# Altium schematic sheet USB_keyholder.SchDoc: Наименование
size 420 x 297 mm; ApprovedBy: Утвердил; CheckedBy: Проверил; Author: Разработал; CompanyName: Организация; DrawnBy: Н.Контр; Engineer: Т.Контр; SheetNumber: 1; SheetTotal: 1; PageSetup: Record=PageOptions|CenterHorizontal=True|CenterVertical=True|PrintScale=0.94|XCorrection=1.00|YCorrection=1.00|PrintKind=1|BorderSize=5000000|LeftOffset=0|BottomOffset=0|Orientation=1|PaperLength=1000|PaperWidth=1000|Scale=100|PaperSource=7|PrintQuality=-4|MediaType=1|DitherType=10|PaperKind=A4|PrintScaleMode=1; DecimalNumber: Децимальный номер; HeadOfSector: Нач. сектора; MainDevice: Перв.примен.; Name: Наименование; DocumentName: Sheet1.SCHDOC
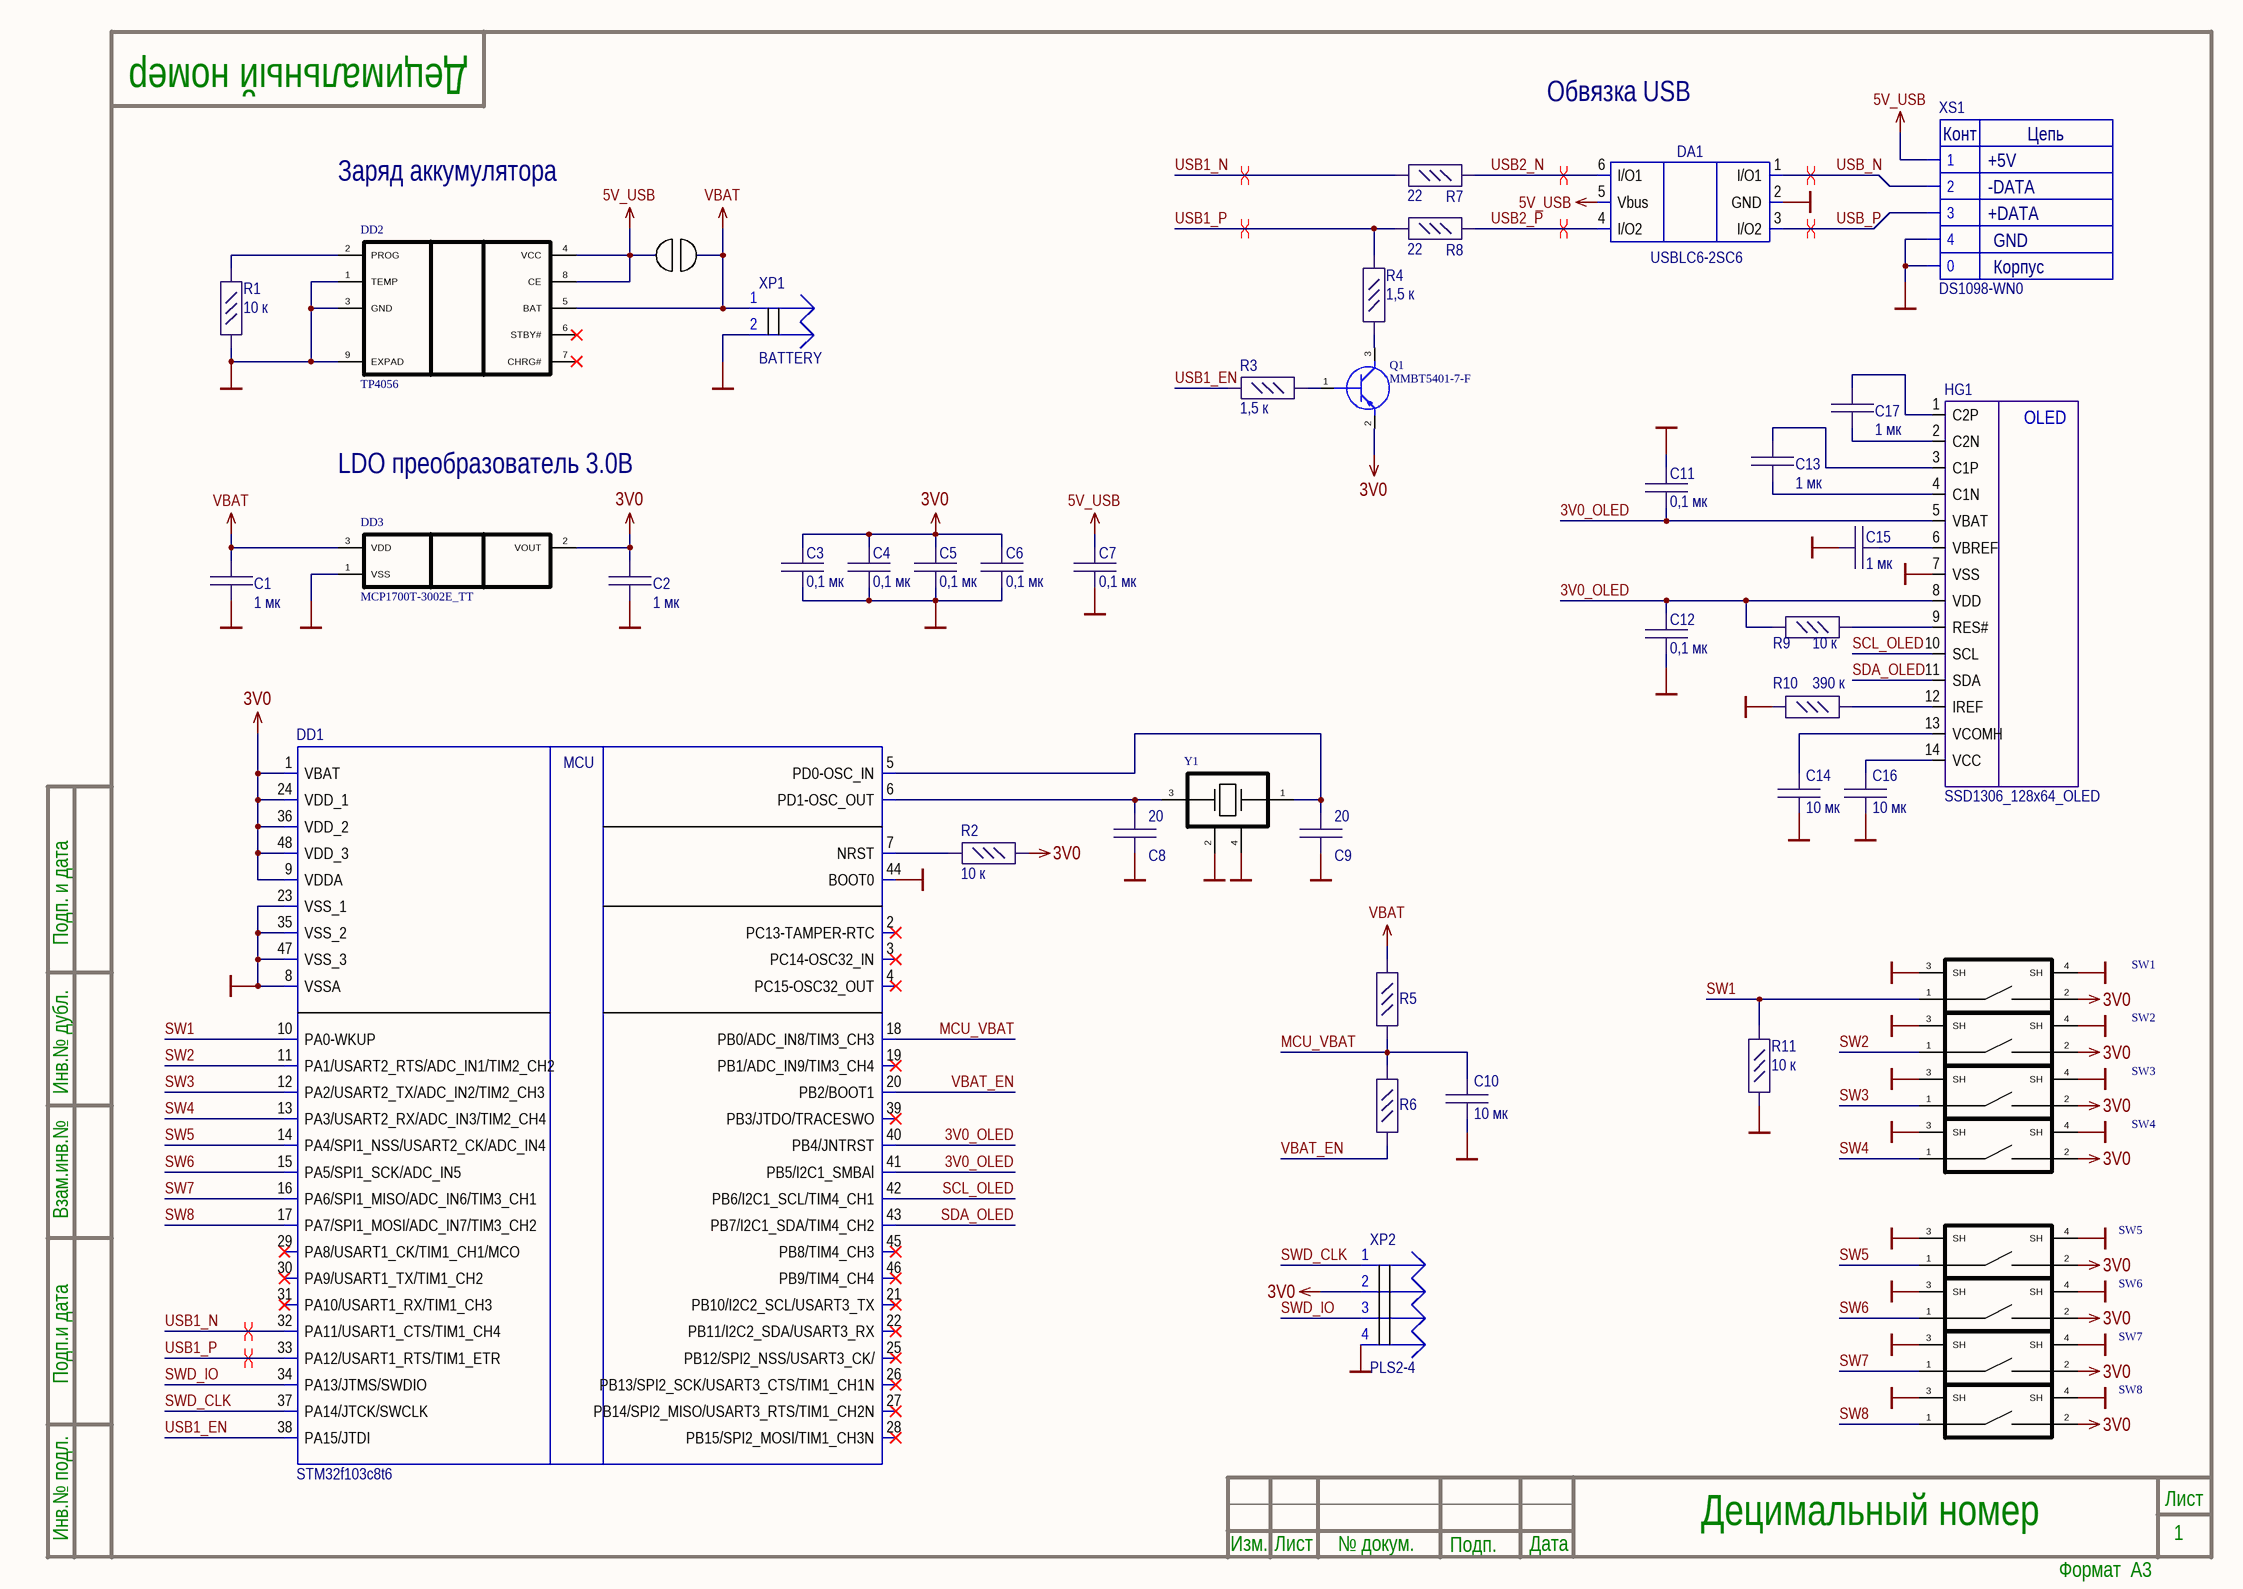
[diagram p0: USB_keyholder.SchDoc]

## Parts
C1  1 мк  [C_0603]
C2  1 мк  [C_0603]
C3  0,1 мк  [C_0603]
C4  0,1 мк  [C_0603]
C5  0,1 мк  [C_0603]
C6  0,1 мк  [C_0603]
C7  0,1 мк  [C_0603]
C8  20  [C_0603]
C9  20  [C_0603]
C10  10 мк  [C_0603]
C11  0,1 мк  [C_0603]
C12  0,1 мк  [C_0603]
C13  1 мк  [C_0603]
C14  10 мк  [C_0603]
C15  1 мк  [C_0603]
C16  10 мк  [C_0603]
C17  1 мк  [C_0603]
DA1  USBLC6-2SC6  [SOT-23-6]
DD1  STM32f103c8t6  [LQFP48]
DD2  TP4056  [SOIC127P600X175-9N]
DD3  MCP1700T-3002E_TT  [SOT95P237X112-3N]
HG1  SSD1306_128х64_OLED  [14_pin_OLED]
Q1  MMBT5401-7-F  [SOT95P240X120-3N]
R1  10 к  [R_0603]
R2  10 к  [R_0603]
R3  1,5 к  [R_0603]
R4  1,5 к  [R_0603]
R5  1 M  [R_0603]  (value not drawn)
R6  1 M  [R_0603]  (value not drawn)
R7  22  [R_0603]
R8  22  [R_0603]
R9  10 к  [R_0603]
R10  390 к  [R_0603]
R11  10 к  [R_0603]
SW1  TSA365G00D  [1TS002G26003500CT]  (value not drawn)
SW2  TSA365G00D  [1TS002G26003500CT]  (value not drawn)
SW3  TSA365G00D  [1TS002G26003500CT]  (value not drawn)
SW4  TSA365G00D  [1TS002G26003500CT]  (value not drawn)
SW5  TSA365G00D  [1TS002G26003500CT]  (value not drawn)
SW6  TSA365G00D  [1TS002G26003500CT]  (value not drawn)
SW7  TSA365G00D  [1TS002G26003500CT]  (value not drawn)
SW8  TSA365G00D  [1TS002G26003500CT]  (value not drawn)
X1  Solder_jumper  [Solder_jumper]  (value not drawn)
XP1  BATTERY  [PLS-2]
XP2  PLS2-4  [4 pin debug]
XS1  DS1098-WN0  [DS1098-WN0]
Y1  X322512MSB4SI  [X322512MSB4SI]  (value not drawn)

## Nets
3V0: C2.2 C3.2 C4.2 C5.2 C6.2 DD1.1(VBAT) DD1.9(VDDA) DD1.24(VDD_1) DD1.36(VDD_2) DD1.48(VDD_3) DD3.2(VOUT) Q1.2(E) R2.1 SW1.2(VOUT) SW2.2(VOUT) SW3.2(VOUT) SW4.2(VOUT) SW5.2(VOUT) SW6.2(VOUT) SW7.2(VOUT) SW8.2(VOUT) XP2.2
5V_USB: C7.2 DA1.5(Vbus) DD2.4(VCC) DD2.8(CE) X1.1 XS1.1
GND: C1.1 C2.1 C3.1 C4.1 C5.1 C6.1 C7.1 C8.1 C9.1 C10.1 C11.2 C12.1 C14.1 C15.2 C16.1 DA1.2(GND) DD1.8(VSSA) DD1.23(VSS_1) DD1.35(VSS_2) DD1.44(BOOT0) DD1.47(VSS_3) DD2.1(TEMP) DD2.3(GND) DD2.9(EXPAD) DD3.1(VSS) HG1.7(VSS) R1.1 R10.1 R11.1 SW1.3(SH) SW1.4(SH) SW2.3(SH) SW2.4(SH) SW3.3(SH) SW3.4(SH) SW4.3(SH) SW4.4(SH) SW5.3(SH) SW5.4(SH) SW6.3(SH) SW6.4(SH) SW7.3(SH) SW7.4(SH) SW8.3(SH) SW8.4(SH) XP1.2 XP2.4 XS1.0 XS1.4 Y1.2 Y1.4
VBAT: C1.2 DD2.5(BAT) DD3.3(VDD) R5.2 X1.2 XP1.1
3V0_OLED: C11.1 C12.2 DD1.40(PB4/JNTRST) DD1.41(PB5/I2C1_SMBAl) HG1.5(VBAT) HG1.8(VDD) R9.2
MCU_VBAT: C10.2 DD1.18(PB0/ADC_IN8/TIM3_CH3) R5.1 R6.2
SCL_OLED: DD1.42(PB6/I2C1_SCL/TIM4_CH1) HG1.10(SCL)
SDA_OLED: DD1.43(PB7/I2C1_SDA/TIM4_CH2) HG1.11(SDA)
SW1: DD1.10(PA0-WKUP) R11.2 SW1.1(VSS)
SW2: DD1.11(PA1/USART2_RTS/ADC_IN1/TIM2_CH2) SW2.1(VSS)
SW3: DD1.12(PA2/USART2_TX/ADC_IN2/TIM2_CH3) SW3.1(VSS)
SW4: DD1.13(PA3/USART2_RX/ADC_IN3/TIM2_CH4) SW4.1(VSS)
SW5: DD1.14(PA4/SPI1_NSS/USART2_CK/ADC_IN4) SW5.1(VSS)
SW6: DD1.15(PA5/SPI1_SCK/ADC_IN5) SW6.1(VSS)
SW7: DD1.16(PA6/SPI1_MISO/ADC_IN6/TIM3_CH1) SW7.1(VSS)
SW8: DD1.17(PA7/SPI1_MOSI/ADC_IN7/TIM3_CH2) SW8.1(VSS)
SWD_CLK: DD1.37(PA14/JTCK/SWCLK) XP2.1
SWD_IO: DD1.34(PA13/JTMS/SWDIO) XP2.3
USB1_EN: DD1.38(PA15/JTDI) R3.2
USB1_N: DD1.32(PA11/USART1_CTS/TIM1_CH4) R7.1
USB1_P: DD1.33(PA12/USART1_RTS/TIM1_ETR) R4.2 R8.1
USB2_N: DA1.6(I/O1) R7.2
USB2_P: DA1.4(I/O2) R8.2
USB_N: DA1.1(I/O1) XS1.2
USB_P: DA1.3(I/O2) XS1.3
VBAT_EN: DD1.20(PB2/BOOT1) R6.1
NetC8_2: C8.2 DD1.6(PD1-OSC_OUT) Y1.3
NetC9_2: C9.2 DD1.5(PD0-OSC_IN) Y1.1
NetC13_1: C13.1 HG1.4(C1N)
NetC13_2: C13.2 HG1.3(C1P)
NetC14_2: C14.2 HG1.13(VCOMH)
NetC15_1: C15.1 HG1.6(VBREF)
NetC16_2: C16.2 HG1.14(VCC)
NetC17_1: C17.1 HG1.2(C2N)
NetC17_2: C17.2 HG1.1(C2P)
NetDD1_7: DD1.7(NRST) R2.2
NetDD2_2: DD2.2(PROG) R1.2
NetHG1_9: HG1.9(RES#) R9.1
NetHG1_12: HG1.12(IREF) R10.2
NetQ1_1: Q1.1(B) R3.1
NetQ1_3: Q1.3(C) R4.1

Not connected (* = marked no-connect by the designer): DD1 2(PC13-TAMPER-RTC)* 3(PC14-OSC32_IN)* 4(PC15-OSC32_OUT)* 19(PB1/ADC_IN9/TIM3_CH4)* 21(PB10/I2C2_SCL/USART3_TX)* 22(PB11/I2C2_SDA/USART3_RX)* 25(PB12/SPI2_NSS/USART3_CK/)* 26(PB13/SPI2_SCK/USART3_CTS/TIM1_CH1N)* 27(PB14/SPI2_MISO/USART3_RTS/TIM1_CH2N)* 28(PB15/SPI2_MOSI/TIM1_CH3N)* 29(PA8/USART1_CK/TIM1_CH1/MCO)* 30(PA9/USART1_TX/TIM1_CH2)* 31(PA10/USART1_RX/TIM1_CH3)* 39(PB3/JTDO/TRACESWO)* 45(PB8/TIM4_CH3)* 46(PB9/TIM4_CH4)*; DD2 6(STBY#)* 7(CHRG#)*

## Layout directives
differential pair: USB1_N, USB1_P, USB2_N, USB2_P, USB_N, USB_P

## Notes on the sheet
- Обвязка USB
- Заряд аккумулятора
- LDO преобразователь 3.0В
- Подп. и дата
- Инв.№ дубл.
- Взам.инв.№
- Подп.и дата
- Инв.№ подл.
- Изм.
- Лист
- № докум.
- Подп.
- Дата
- Формат  A3
- (in symbol DS1098-WN0) Конт; Цепь; +5V; -DATA; +DATA; GND; Корпус
- (in symbol SSD1306_128х64_OLED) OLED
- (in symbol STM32f103c8t6) MCU

## Library data of the parts
C1 C2 C13 C15 C17 = GRM188R61E225MA12D: CAP CER 2.2UF 25V X5R 0603; Manufacturer: Murata Electronics; Value: 1µF; Part Number: GRM188R61E225MA12D; ComponentLink1URL: https://search.murata.co.jp/Ceramy/image/img/A01X/G101/ENG/GRM188R61E225MA12-01.pdf; ComponentLink1Description: Datasheet; Component Type: Capasitor; LCSC Part #: C15849
C3-C7 C11 C12 = GRM188R72A104MA35D: CAP CER 0.1UF 100V X7R 0603; Manufacturer: Murata Electronics; Value: 0.1µF; Part Number: GRM188R72A104MA35D; ComponentLink1URL: https://search.murata.co.jp/Ceramy/image/img/A01X/G101/ENG/GRM188R72A104MA35-01.pdf; ComponentLink1Description: Datasheet; Component Type: Capasitor; LCSC Part #: C14663
C8 C9 = GRM1885C1H100FA01D: CAP CER 20PF 50V C0G/NP0 0603; Manufacturer: Murata Electronics; Part Number: GRM1885C1H100FA01D; Value: 20pF; ComponentLink1URL: https://www.murata.com/~/media/webrenewal/support/library/catalog/products/capacitor/mlcc/c02e.ashx?la=en-us; ComponentLink1Description: Datasheet; Component Type: Capasitor; LCSC Part #: C1648
C10 C14 C16 = GRM188R61A106KE69J: CAP CER 10UF 10V X5R 0603; Manufacturer: Murata Electronics; Value: 10µF; Part Number: GRM188R61A106KE69J; ComponentLink1URL: https://search.murata.co.jp/Ceramy/image/img/A01X/G101/ENG/GRM188R61A106KE69-01.pdf; ComponentLink1Description: Datasheet; Component Type: Capasitor; LCSC Part #: C19702
DD2 = TP4056: Li Ion charger; LCSC Part #: C16581
Q1 = MMBT5401-7-F: Transistor BJT PNP; Manufacturer_Name: Diodes Inc.; Datasheet Link: https://www.diodes.com/assets/Datasheets/ds30057.pdf; Height: 1.2mm; Manufacturer_Part_Number: MMBT5401-7-F; Mouser Part Number: 621-MMBT5401-F; Mouser Price/Stock: https://www.mouser.co.uk/ProductDetail/Diodes-Incorporated/MMBT5401-7-F?qs=i73nB8jq7%2FziVmdJmjed1Q%3D%3D; Arrow Part Number: MMBT5401-7-F; Arrow Price/Stock: https://www.arrow.com/en/products/mmbt5401-7-f/diodes-incorporated?region=nac; LCSC Part #: C8326
R1 R2 R9 R11 = CR0603-FX-1002ELF: RES SMD 10K OHM 1% 1/10W 0603; Manufacturer: Bourns Inc.; Part Number: CR0603-FX-1002ELF; Value: 10 к; ComponentLink1URL: https://www.bourns.com/pdfs/chpreztr.pdf; ComponentLink1Description: Datasheet; Component Type: Resistor; LCSC Part #: C25804
R3 R4 = CR0603-FX-1501ELF: RES SMD 1.5K OHM 1% 1/10W 0603; Manufacturer: Bourns Inc.; Part Number: CR0603-FX-1501ELF; Value: 1,5 к; ComponentLink1URL: https://www.bourns.com/pdfs/chpreztr.pdf; ComponentLink1Description: Datasheet; Component Type: Resistor; LCSC Part #: C22843
R5 R6 = CR0603-FX-1004ELF: RES SMD 1M OHM 1% 1/10W 0603; Manufacturer: Bourns Inc.; Part Number: CR0603-FX-1004ELF; Value: 1 M; ComponentLink1URL: https://www.bourns.com/pdfs/chpreztr.pdf; ComponentLink1Description: Datasheet; Component Type: Resistor; LCSC Part #: C22935
R7 R8 = CR0603-FX-22R0ELF: RES SMD 22 OHM 1% 1/10W 0603; Manufacturer: Bourns Inc.; Part Number: CR0603-FX-22R0ELF; Value: 22; ComponentLink1URL: https://www.bourns.com/pdfs/chpreztr.pdf; ComponentLink1Description: Datasheet; Component Type: Resistor; LCSC Part #: C23345
R10 = CR0603-FX-3903ELF: RES SMD 390K OHM 1% 1/10W 0603; Manufacturer: Bourns Inc.; Part Number: CR0603-FX-3903ELF; Value: 390 к; ComponentLink1URL: https://www.bourns.com/pdfs/chpreztr.pdf; ComponentLink1Description: Datasheet; Component Type: Resistor; LCSC Part #: C23150
XP1 = PLS-2
Y1 = X322512MSB4SI: 12MHz Crystal resonator; LCSC Part #: C9002
DA1 = USBLC6-2SC6: HelpURL: https://static.chipdip.ru/lib/093/DOC001093117.pdf
DD3 = MCP1700T-3002E_TT: LCSC Part #: C62244